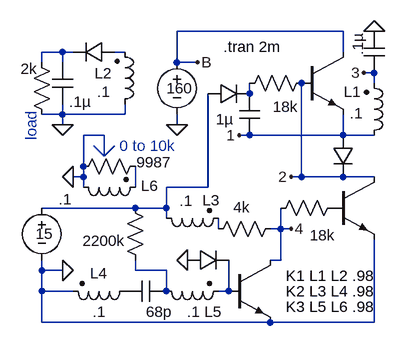
[diagram p0: schematic low_power-flyback_buster-transistor-12609.asc]
low_power-flyback_buster-transistor-12609.asc, the LTspice schematic file:
Version 4
SHEET 1 1624 1340
WIRE 400 -400 144 -400
WIRE -32 -368 -64 -368
WIRE -16 -368 -32 -368
WIRE 64 -368 48 -368
WIRE 400 -368 400 -400
WIRE -64 -352 -64 -368
WIRE -32 -352 -32 -368
WIRE 144 -352 144 -400
WIRE 176 -352 144 -352
WIRE 448 -336 432 -336
WIRE 448 -320 448 -336
WIRE 256 -304 256 -320
WIRE -32 -272 -32 -288
WIRE -32 -272 -64 -272
WIRE 64 -272 64 -288
WIRE 64 -272 -32 -272
WIRE -32 -256 -32 -272
WIRE 144 -256 144 -272
WIRE 32 -240 0 -240
WIRE 256 -240 240 -240
WIRE 400 -240 400 -272
WIRE 400 -240 256 -240
WIRE 448 -240 400 -240
WIRE 32 -208 32 -240
WIRE 0 -192 0 -240
WIRE 0 -176 0 -192
WIRE 0 -176 -16 -176
WIRE 336 -176 336 -320
WIRE 336 -176 320 -176
WIRE 400 -176 336 -176
WIRE 448 -176 400 -176
WIRE 0 -160 0 -176
WIRE 80 -160 80 -192
WIRE 192 -160 192 -304
WIRE 192 -160 128 -160
WIRE 80 -128 -64 -128
WIRE 128 -128 128 -160
WIRE 128 -128 80 -128
WIRE 128 -112 128 -128
WIRE 208 -96 208 -112
WIRE 304 -96 304 -128
WIRE 304 -96 288 -96
WIRE 320 -96 304 -96
WIRE 304 -48 304 -96
WIRE 304 -48 288 -48
WIRE -64 -32 -64 -48
WIRE -32 -32 -64 -32
WIRE 80 -32 80 -48
WIRE 128 -32 80 -32
WIRE -64 0 -64 -32
WIRE -16 0 -64 0
WIRE 128 0 128 -32
WIRE 224 0 224 -48
WIRE 224 0 208 0
WIRE -64 48 -64 0
WIRE 288 48 -64 48
WIRE 448 48 448 -80
WIRE 448 48 288 48
FLAG -32 -32 0
FLAG 320 -176 2
FLAG 432 -336 3
FLAG 160 -48 0
FLAG -32 -256 0
FLAG 320 -96 4
FLAG 144 -256 0
FLAG 240 -240 1
FLAG 176 -352 B
FLAG -16 -176 0
FLAG 448 -400 0
SYMBOL ind2 432 -224 M180
WINDOW 0 -31 83 Left 0
WINDOW 3 -22 50 Left 0
SYMATTR InstName L1
SYMATTR Value .1
SYMATTR SpiceLine Rser=50
SYMBOL voltage -64 -144 R0
WINDOW 3 4 71 Bottom 0
WINDOW 123 -32 56 VBottom 0
WINDOW 0 -7 59 Invisible 0
SYMATTR Value 15
SYMATTR InstName V1
SYMATTR SpiceLine Rser=.01
SYMBOL res 96 -32 R180
WINDOW 0 36 76 Invisible 0
WINDOW 3 31 46 Left 0
SYMATTR InstName R14
SYMATTR Value 2200k
SYMBOL cap 128 -16 R90
WINDOW 0 0 32 Invisible 0
WINDOW 3 32 11 VTop 0
SYMATTR InstName C2
SYMATTR Value 68p
SYMBOL res -16 -176 R270
WINDOW 0 32 56 Invisible 0
WINDOW 3 38 125 VBottom 0
SYMATTR InstName R5
SYMATTR Value 9987
SYMBOL cap 240 -304 R0
WINDOW 0 -56 78 Invisible 0
WINDOW 3 -22 24 Top 0
SYMATTR InstName C1
SYMATTR Value 1µ
SYMBOL res -48 -256 R180
WINDOW 0 36 76 Invisible 0
WINDOW 3 23 86 Left 0
SYMATTR InstName R2
SYMATTR Value 2k
SYMBOL diode 160 -64 M90
WINDOW 0 0 32 Invisible 0
WINDOW 3 32 32 Invisible 0
SYMATTR InstName D4
SYMATTR Value 1N4148
SYMATTR Description Schottky diode
SYMATTR Type schottky
SYMBOL npn2 224 -48 R0
WINDOW 0 56 32 Invisible 0
WINDOW 3 43 40 Invisible 0
SYMATTR InstName Q3
SYMATTR Value 2N3904
SYMBOL voltage 144 -368 R0
WINDOW 3 4 71 Bottom 0
WINDOW 123 -32 56 VBottom 0
WINDOW 0 -7 59 Invisible 0
SYMATTR Value 160
SYMATTR InstName V2
SYMATTR SpiceLine Rser=.01
SYMBOL ind2 48 -272 M180
WINDOW 0 -31 63 Left 0
WINDOW 3 -27 35 Left 0
SYMATTR InstName L2
SYMATTR Value .1
SYMATTR SpiceLine Rser=50
SYMBOL cap -48 -352 R0
WINDOW 0 -56 78 Invisible 0
WINDOW 3 43 45 Top 0
SYMATTR InstName C3
SYMATTR Value .1µ
SYMBOL cap 432 -400 R0
WINDOW 0 -56 78 Invisible 0
WINDOW 3 -25 21 VTop 0
SYMATTR InstName C4
SYMATTR Value .1µ
SYMBOL res 240 -304 R270
WINDOW 0 32 56 Invisible 0
WINDOW 3 -5 71 VBottom 0
SYMATTR InstName R8
SYMATTR Value 18k
SYMBOL ind2 112 -128 M90
WINDOW 0 4 85 VBottom 0
WINDOW 3 -27 46 VTop 0
SYMATTR InstName L3
SYMATTR Value .1
SYMATTR SpiceLine Rser=50
SYMBOL ind2 112 -16 M90
WINDOW 0 63 88 VBottom 0
WINDOW 3 32 58 VTop 0
SYMATTR InstName L5
SYMATTR Value .1
SYMATTR SpiceLine Rser=50
SYMBOL ind2 -16 -176 M90
WINDOW 0 29 118 VBottom 0
WINDOW 3 19 -12 VTop 0
SYMATTR InstName L6
SYMATTR Value .1
SYMATTR SpiceLine Rser=50
SYMBOL res 192 -80 R270
WINDOW 0 32 56 Invisible 0
WINDOW 3 65 52 VBottom 0
SYMATTR InstName R7
SYMATTR Value 4k
SYMBOL ind2 80 -16 R90
WINDOW 0 4 56 VBottom 0
WINDOW 3 32 56 VTop 0
SYMATTR InstName L4
SYMATTR Value .1
SYMATTR SpiceLine Rser=50
SYMBOL diode 192 -320 M90
WINDOW 0 0 32 Invisible 0
WINDOW 3 32 32 Invisible 0
SYMATTR InstName D8
SYMATTR Value 1N4148
SYMATTR Description Schottky diode
SYMATTR Type schottky
SYMBOL diode 384 -240 R0
WINDOW 0 24 0 Invisible 0
WINDOW 3 24 72 Invisible 0
SYMATTR InstName D9
SYMATTR Value 1N4148
SYMBOL diode 48 -384 R90
WINDOW 0 0 32 Invisible 0
WINDOW 3 32 32 Invisible 0
SYMATTR InstName D2
SYMATTR Value 1N4148
SYMATTR Description Schottky diode
SYMATTR Type schottky
SYMBOL npn2 384 -176 R0
WINDOW 0 56 32 Invisible 0
WINDOW 3 43 40 Invisible 0
SYMATTR InstName Q1
SYMATTR Value 2N5550
SYMBOL res 288 -112 R270
WINDOW 0 32 56 Invisible 0
WINDOW 3 -10 80 VBottom 0
SYMATTR InstName R1
SYMATTR Value 18k
SYMBOL npn2 336 -368 R0
WINDOW 0 56 32 Invisible 0
WINDOW 3 43 40 Invisible 0
SYMATTR InstName Q2
SYMATTR Value 2N5550
TEXT 216 -376 Left 0 !.tran 2m
TEXT 56 -224 Left 0 ;0 to 10k
TEXT 312 -24 Left 0 !K1 L1 L2 .98
TEXT 312 0 Left 0 !K2 L3 L4 .98
TEXT 312 24 Left 0 !K3 L5 L6 .98
TEXT -80 -232 VLeft 0 ;load
LINE Normal 48 -224 32 -208
LINE Normal 16 -224 32 -208

The netlist it stands for:
* low_power-flyback_buster-transistor-12609.asc
L1 1 3 .1 Rser=50
V1 N005 0 15 Rser=.01
R14 N007 N005 2200k
C2 N007 P001 68p
R5 0 N004 9987
C1 N003 1 1µ
R2 0 N001 2k
D4 0 N008 1N4148
Q3 4 N008 0 0 2N3904
V2 B 0 160 Rser=.01
L2 0 N002 .1 Rser=50
C3 N001 0 .1µ
C4 0 3 .1µ
R8 N003 2 18k
L3 N005 N006 .1 Rser=50
L5 N007 N008 .1 Rser=50
L6 0 N004 .1 Rser=50
R7 N006 4 4k
L4 P001 0 .1 Rser=50
D8 N005 N003 1N4148
D9 1 2 1N4148
D2 N002 N001 1N4148
Q1 2 P002 0 0 2N5550
R1 4 P002 18k
Q2 B 2 1 0 2N5550
.model D D
.lib standard.dio
.model NPN NPN
.model PNP PNP
.lib standard.bjt
.tran 2m
* 0 to 10k
K1 L1 L2 .98
K2 L3 L4 .98
K3 L5 L6 .98
* load
.backanno
.end